# EasyEDA Pro project Const_IMU.eprj

# Schematic Schematic1
Create Date: 2024-10-29; Page Name: P1; Project Name: Const_IMU; Schematic Name: Schematic1; Update Date: 2024-10-30; Company: 嘉立创EDA; Page Size: A4; Version: V1.0
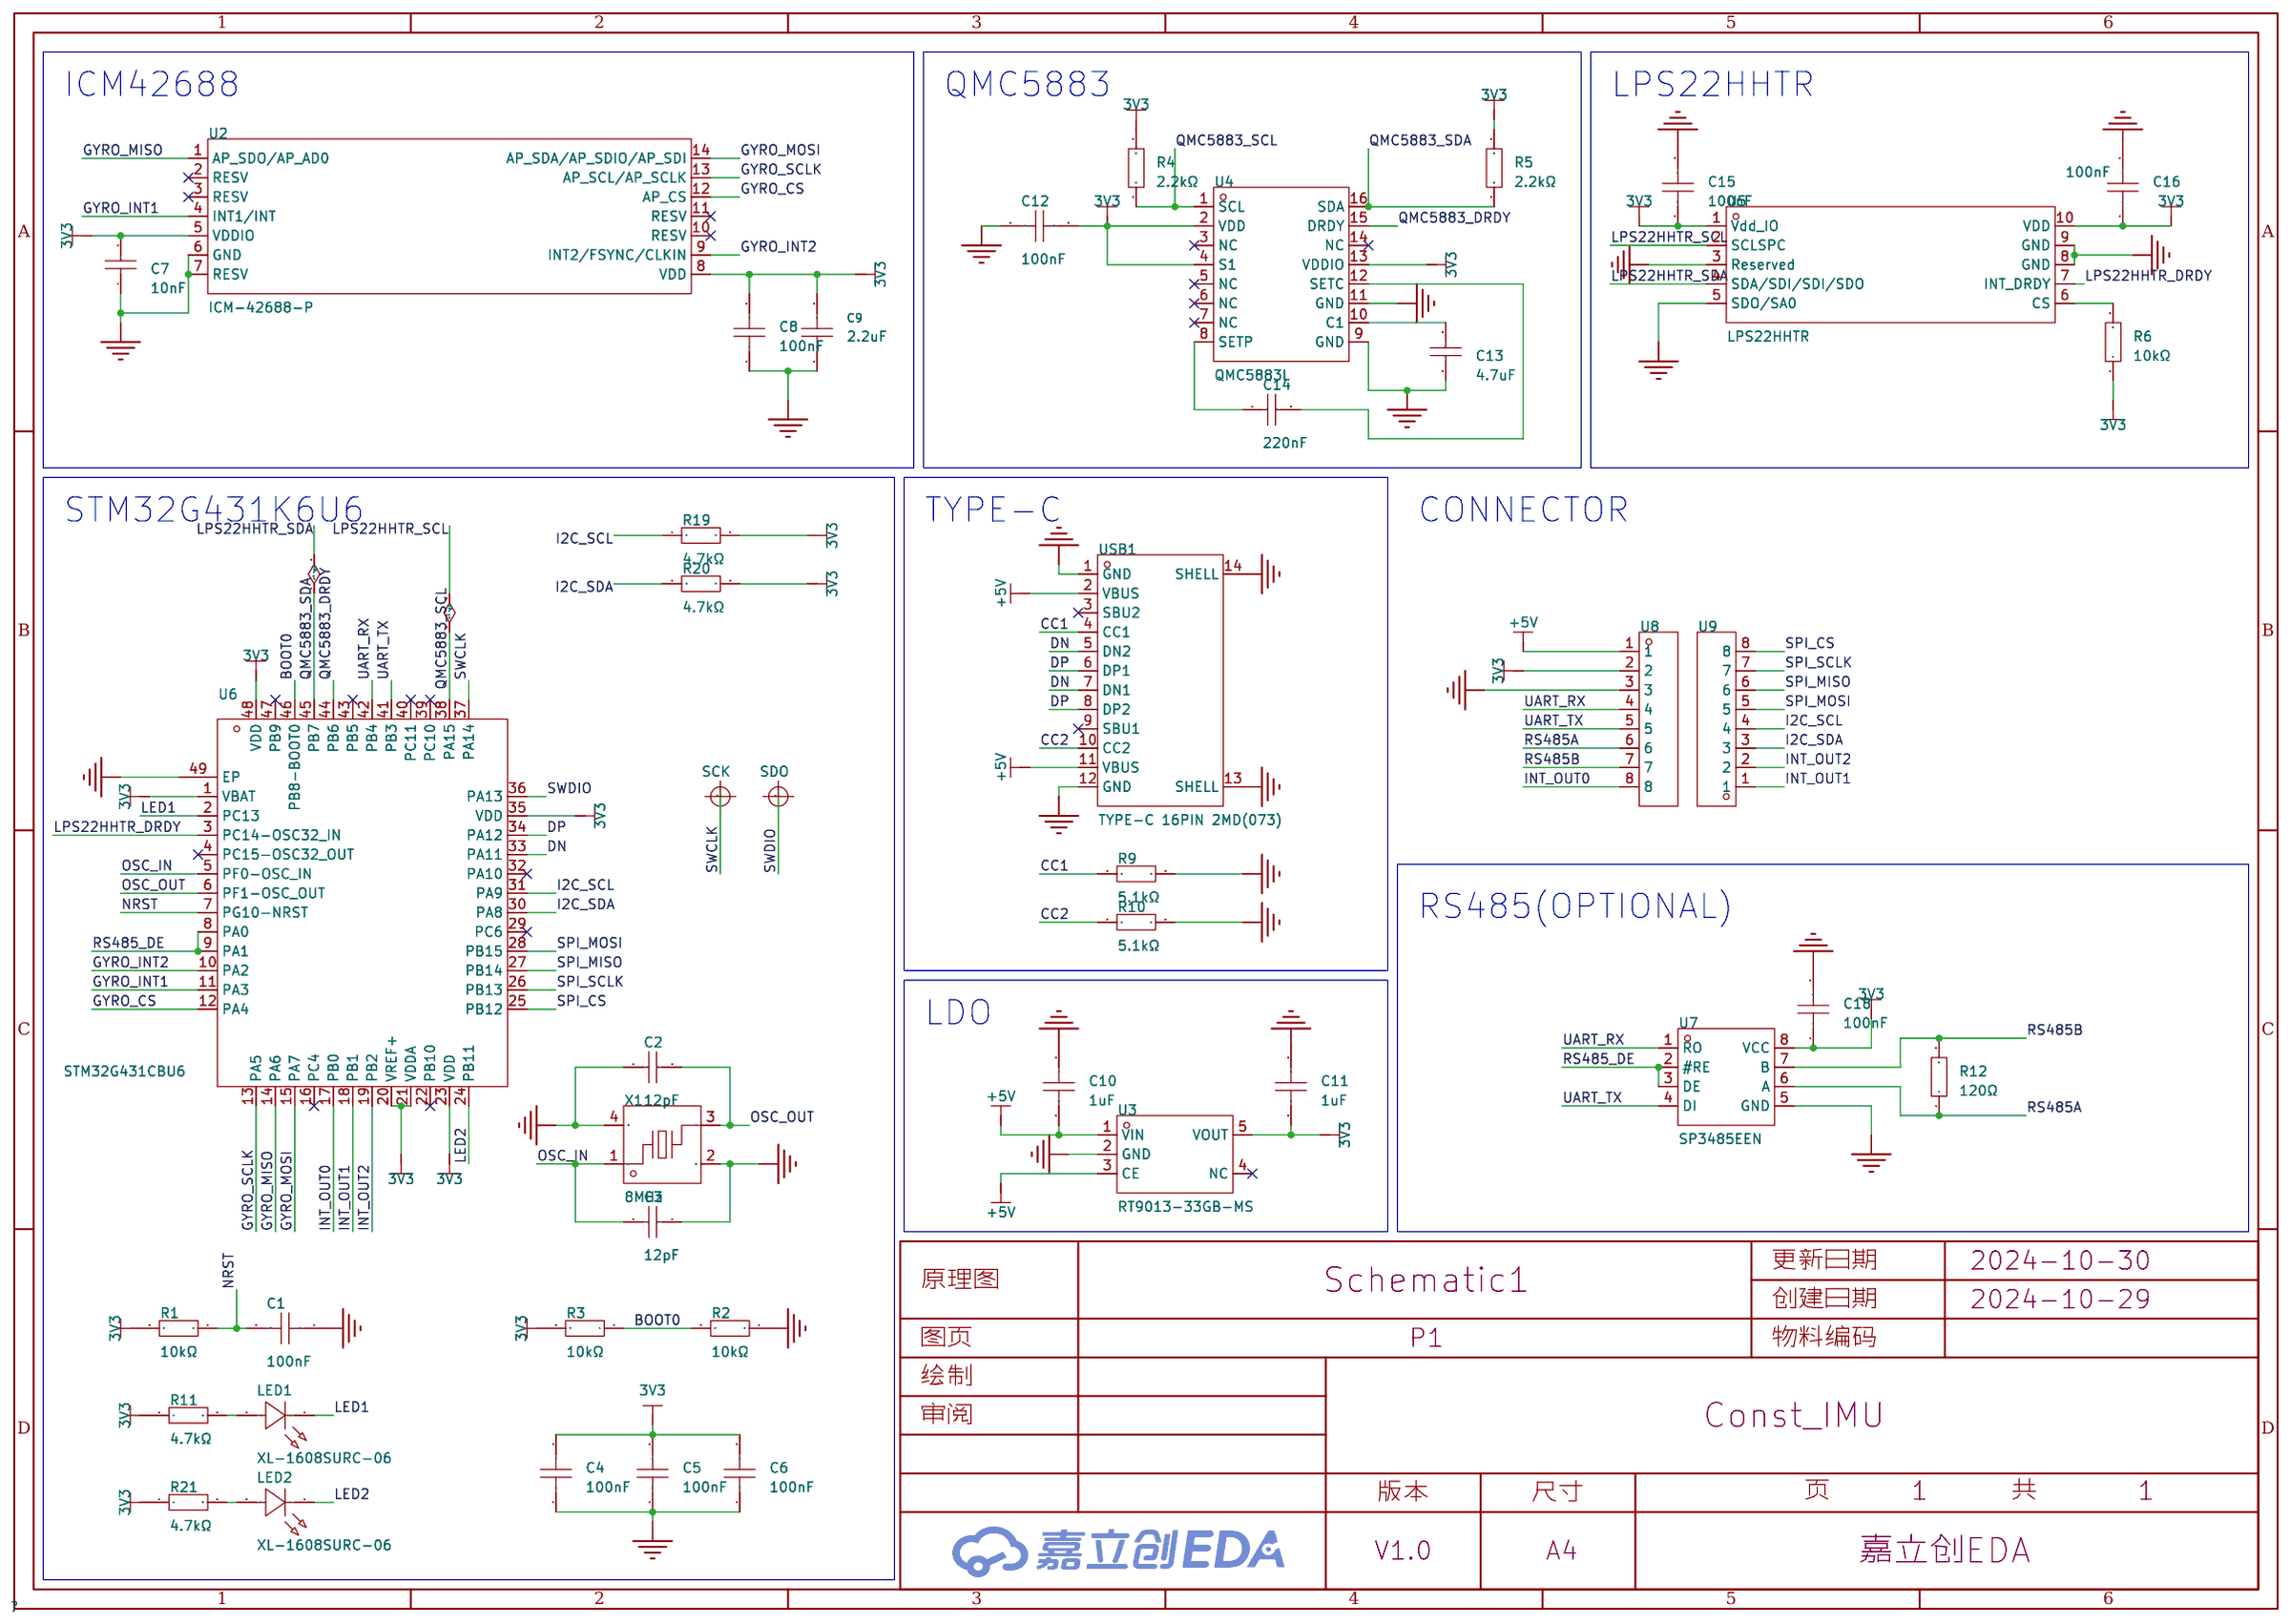
[diagram p0: schematic sheet]

## Parts
C1  100nF  [C0603]
C2  12pF  [C0603]
C3  12pF  [C0603]
C4  100nF  [C0603]
C5  100nF  [C0603]
C6  100nF  [C0603]
C7  10nF  [C0603]
C8  100nF  [C0603]
C9  2.2uF  [C0603]
C10  1uF  [C0603]
C11  1uF  [C0603]
C12  100nF  [C0603]
C13  4.7uF  [C0603]
C14  220nF  [C0603]
C15  100nF  [C0603]
C16  100nF  [C0603]
C18  100nF  [C0603]
LED1  XL-1608SURC-06  [LED0603-RD_RED]
LED2  XL-1608SURC-06  [LED0603-RD_RED]
R1  10kΩ  [R0603]
R2  10kΩ  [R0603]
R3  10kΩ  [R0603]
R4  2.2kΩ  [R0603]
R5  2.2kΩ  [R0603]
R6  10kΩ  [R0603]
R9  5.1kΩ  [R0603]
R10  5.1kΩ  [R0603]
R11  4.7kΩ  [R0603]
R12  120Ω  [R0603]
R19  4.7kΩ  [R0603]
R20  4.7kΩ  [R0603]
R21  4.7kΩ  [R0603]
SCK  -  [Mark-Point-1mm]  (no BOM)
SDO  -  [Mark-Point-1mm]  (no BOM)
U2  ICM-42688-P  [LGA-14_L3.0-W2.5-P0.50-TL]
U3  RT9013-33GB-MS  [SOT-23-5_L2.9-W1.6-P0.95-LS2.8-BR]
U4  QMC5883L  [LGA-16_L3.0-W3.0-P0.50-BL_SQ]
U5  LPS22HHTR  [HLGA-10L_LPS22HBTR]
U6  STM32G431CBU6  [UFQFPN-48_L7.0-W7.0-P0.50-BL-EP]
U7  SP3485EEN  [sop-8_l5.0-w4.0-p1.27-ls6.0-bl]
U8  HB-PH3-25418PB2GOP  [HDR-TH_8P-P2.54-V-M]
U9  HB-PH3-25418PB2GOP  [HDR-TH_8P-P2.54-V-M]
USB1  TYPE-C 16PIN 2MD(073)  [USB-C-SMD_TYPE-C-6PIN-2MD-073]
X1  8MHz  [OSC-SMD_4P-L3.2-W2.5-BL]

## Library data of the parts
C1 C4-C6 C8 C12 C15 C16 C18 = CGA0603X7R104K500JT: 容值:100nF;精度:±10%;额定电压:50V;材质(温度系数):X7R;; LCSC Part Name: 100nF ±10% 50V; Supplier Part: C6119867; Manufacturer: HRE(芯声); Supplier Footprint: 0603; JLCPCB Part Class: 扩展库; Supplier: LCSC; Tolerance: ±10%; Voltage Rated: 50V; Temperature Coefficient: X7R
C2 C3 = CL10C120JB8NNNC: 容值:12pF;精度:±5%;额定电压:50V;材质(温度系数):C0G;; LCSC Part Name: 12pF ±5% 50V; Supplier Part: C38523; Manufacturer: SAMSUNG(三星); Supplier Footprint: 0603; JLCPCB Part Class: Basic Part; Datasheet: https://atta.szlcsc.com/upload/public/pdf/source/20160218/1457707763339.pdf; Supplier: LCSC; Tolerance: ±5%; Voltage Rated: 50V; Temperature Coefficient: C0G
C7 = CC0603KRX7R9BB103: 容值:10nF;精度:±10%;额定电压:50V;材质(温度系数):X7R;; LCSC Part Name: 10nF ±10% 50V; Supplier Part: C100042; Manufacturer: YAGEO(国巨); Supplier Footprint: 0603; JLCPCB Part Class: Extended Part; Datasheet: https://atta.szlcsc.com/upload/public/pdf/source/20181008/C309510_22F155564471FAF6A489F7D68F34234E.pdf; Supplier: LCSC; Tolerance: ±10%; Voltage Rated: 50V; Temperature Coefficient: X7R
C9 = CL10A225KB8NNNC: 容值:2.2uF;精度:±10%;额定电压:50V;材质(温度系数):X5R;; LCSC Part Name: 2.2uF ±10% 50V; Supplier Part: C913904; Manufacturer: SAMSUNG(三星); Supplier Footprint: 0603; JLCPCB Part Class: 扩展库; Datasheet: https://atta.szlcsc.com/upload/public/pdf/source/20160218/1457707763339.pdf; Supplier: LCSC; Tolerance: ±10%; Voltage Rated: 50V; Temperature Coefficient: X5R
C10 C11 = CGA0603X5R105K160JT: 容值:1uF;精度:±10%;额定电压:16V;材质(温度系数):X5R;; LCSC Part Name: 1uF ±10% 16V; Supplier Part: C6119849; Manufacturer: HRE(芯声); Supplier Footprint: 0603; JLCPCB Part Class: Extended Part; Supplier: LCSC; Tolerance: ±10%; Voltage Rated: 16V; Temperature Coefficient: X5R
C13 = CL10A475KO8NNNC: 容值:4.7uF;精度:±10%;额定电压:16V;材质(温度系数):X5R;; LCSC Part Name: 4.7uF ±10% 16V; Supplier Part: C19666; Manufacturer: SAMSUNG(三星); Supplier Footprint: 0603; JLCPCB Part Class: Basic Part; Datasheet: https://atta.szlcsc.com/upload/public/pdf/source/20160218/1457707763339.pdf; Supplier: LCSC; Tolerance: ±10%; Voltage Rated: 16V; Temperature Coefficient: X5R
C14 = CL10B224KA8NNNC: 容值:220nF;精度:±10%;额定电压:25V;材质(温度系数):X7R;; LCSC Part Name: 220nF ±10% 25V; Supplier Part: C21120; Manufacturer: SAMSUNG(三星); Supplier Footprint: 0603; JLCPCB Part Class: Basic Part; Datasheet: https://atta.szlcsc.com/upload/public/pdf/source/20160218/1457707763339.pdf; Supplier: LCSC; Tolerance: ±10%; Voltage Rated: 25V; Temperature Coefficient: X7R
LED1 LED2 = XL-1608SURC-06: 发光颜色:红色;功率:55mW;正向电流:25mA;主波长:617nm~621nm;透镜颜色:无色透明透镜;色温:-;发光角度:120°;载带方式:正贴;工作温度:-30℃~+85℃;; Supplier Part: C965799; Manufacturer: XINGLIGHT(成兴光); Supplier Footprint: 0603; JLCPCB Part Class: Extended Part; Datasheet: https://atta.szlcsc.com/upload/public/pdf/source/20221102/D860AFDD1CDB02C5A8064103A32707E2.pdf; Supplier: LCSC; Emitted Color: 红色; Power Dissipation: 55mW; Forward Current: 25mA; Dominant Wavelength: 617nm~621nm; Peak Wavelength: 623nm; Lens Color: 无色透明透镜; Viewing Angle: 120°; Mounting Sytle: 正贴; Operating Temperature: -30℃~+85℃
R1-R3 R6 = 0603WAF1002T5E: 电阻类型:厚膜电阻;阻值:10kΩ;精度:±1%;功率:100mW;最大工作电压:75V;温度系数:±100ppm/℃;; LCSC Part Name: 厚膜电阻 10kΩ ±1% 100mW; Supplier Part: C25804; Manufacturer: UNI-ROYAL(厚声); Supplier Footprint: 0603; JLCPCB Part Class: Basic Part; Datasheet: https://atta.szlcsc.com/upload/public/pdf/source/20200306/C422600_1E6D84923E4A46A82E41ADD87F860B5C.pdf; Supplier: LCSC; Type: 厚膜电阻; Tolerance: ±1%; Power(Watts): 100mW; Overload Voltage (Max): 75V; Temperature Coefficient: ±100ppm/℃; Operating Temperature Range: -55℃~+155℃
R4 R5 = 0603WAF2201T5E: 电阻类型:厚膜电阻;阻值:2.2kΩ;精度:±1%;功率:100mW;最大工作电压:75V;温度系数:±100ppm/℃;; LCSC Part Name: 2.2kΩ ±1% 100mW 厚膜电阻; Supplier Part: C4190; Manufacturer: UNI-ROYAL(厚声); Supplier Footprint: 0603; JLCPCB Part Class: 基础库; Datasheet: https://atta.szlcsc.com/upload/public/pdf/source/20200306/C422600_1E6D84923E4A46A82E41ADD87F860B5C.pdf; Supplier: LCSC; Type: 厚膜电阻; Tolerance: ±1%; Power(Watts): 100mW; Overload Voltage (Max): 75V; Temperature Coefficient: ±100ppm/℃; Operating Temperature Range: -55℃~+155℃
R9 R10 = 0603WAF5101T5E: 电阻类型:厚膜电阻;阻值:5.1kΩ;精度:±1%;功率:100mW;最大工作电压:75V;温度系数:±100ppm/℃;; LCSC Part Name: 5.1kΩ ±1% 100mW 厚膜电阻; Supplier Part: C23186; Manufacturer: UNI-ROYAL(厚声); Supplier Footprint: 0603; JLCPCB Part Class: Basic Part; Datasheet: https://atta.szlcsc.com/upload/public/pdf/source/20200306/C422600_1E6D84923E4A46A82E41ADD87F860B5C.pdf; Supplier: LCSC; Type: 厚膜电阻; Tolerance: ±1%; Power(Watts): 100mW; Overload Voltage (Max): 75V; Temperature Coefficient: ±100ppm/℃; Operating Temperature Range: -55℃~+155℃
R11 R19-R21 = 0603WAF4701T5E: 电阻类型:厚膜电阻;阻值:4.7kΩ;精度:±1%;功率:100mW;最大工作电压:75V;温度系数:±100ppm/℃;; LCSC Part Name: 4.7kΩ ±1% 100mW 厚膜电阻; Supplier Part: C23162; Manufacturer: UNI-ROYAL(厚声); Supplier Footprint: 0603; JLCPCB Part Class: 基础库; Datasheet: https://atta.szlcsc.com/upload/public/pdf/source/20200306/C422600_1E6D84923E4A46A82E41ADD87F860B5C.pdf; Supplier: LCSC; Type: 厚膜电阻; Tolerance: ±1%; Power(Watts): 100mW; Overload Voltage (Max): 75V; Temperature Coefficient: ±100ppm/℃; Operating Temperature Range: -55℃~+155℃
R12 = 0603WAF1200T5E: 电阻类型:厚膜电阻;阻值:120Ω;精度:±1%;功率:100mW;最大工作电压:75V;温度系数:±100ppm/℃;; LCSC Part Name: 120Ω ±1% 100mW 厚膜电阻; Supplier Part: C22787; Manufacturer: UNI-ROYAL(厚声); Supplier Footprint: 0603; JLCPCB Part Class: Basic Part; Datasheet: https://atta.szlcsc.com/upload/public/pdf/source/20200306/C422600_1E6D84923E4A46A82E41ADD87F860B5C.pdf; Supplier: LCSC; Type: 厚膜电阻; Tolerance: ±1%; Power(Watts): 100mW; Overload Voltage (Max): 75V; Temperature Coefficient: ±100ppm/℃; Operating Temperature Range: -55℃~+155℃
SCK SDO = Mark-Point: Mark点
U2 = ICM-42688-P: 传感器类型:加速度计陀螺仪;; Supplier Part: C1850418; Manufacturer: TDK InvenSense(应美盛); Supplier Footprint: LGA-14(2.5x3); JLCPCB Part Class: 扩展库; Datasheet: https://atta.szlcsc.com/upload/public/pdf/source/20210703/CF24204867ACE5B754A2B035F23E5931.pdf; Supplier: LCSC; Sensor Type: 加速度计陀螺仪
U3 = RT9013-33GB-MS: 输出类型:固定;最大输入电压:5.5V;输出电压:3.3V;最大输出电流:500mA;电源纹波抑制比(PSRR):75dB@(1kHz);输出极性:正极;; Supplier Part: C7434207; Manufacturer: MSKSEMI(美森科); Supplier Footprint: SOT-23-5; JLCPCB Part Class: 扩展库; Datasheet: https://atta.szlcsc.com/upload/public/pdf/source/20230705/1D6536D82D93AC1E044F3DAE104751D9.pdf; Supplier: LCSC; Output Type: 固定; Maximum Input Voltage: 5.5V; Output Voltage: 3.3V; MAX Output Current: 500mA; Power Supply Rejection Ratio (PSRR): 75dB@(1kHz); Output Polarity: 正极
U4 = QMC5883L: LCSC Part Name: 三轴磁传感器; Supplier Part: C976032; Manufacturer: QST(上海矽睿); Supplier Footprint: LGA-16(3x3); JLCPCB Part Class: 扩展库; Datasheet: https://atta.szlcsc.com/upload/public/pdf/source/20201217/C976032_5B9A2F3901E175046CBA037B1F18A1F2.pdf; Supplier: LCSC
U5 = LPS22HHTR: 压力范围:26Kpa~126Kpa;; Supplier Part: C2827824; Manufacturer: ST(意法半导体); Supplier Footprint: HLGA-10(2x2); JLCPCB Part Class: 扩展库; Datasheet: https://atta.szlcsc.com/upload/public/pdf/source/20210707/C2827824_E4CD2E1AEEC461DC537A3A43C6466376.pdf; Supplier: LCSC; Pressure range: 26Kpa~126Kpa; The Power Supply Voltage: 1.7V~3.6V; Operating Temperature: -40℃~+85℃
U6 = STM32G431CBU6: CPU内核:-;程序存储容量:128KB;RAM总容量:32KB;GPIO端口数量:42;工作电压范围:1.71V~3.6V;CPU最大主频:170MHz;程序存储器类型:FLASH;; LCSC Part Name: 带DSP和FPU的170MHz主流ARM Cortex-M4 MCU，具有128 KB Flash存储器、数学加速器和中等模拟电平集成; Supplier Part: C529356; Manufacturer: ST(意法半导体); Supplier Footprint: UFQFPN-48(7x7); JLCPCB Part Class: 扩展库; Datasheet: https://atta.szlcsc.com/upload/public/pdf/source/20200511/C529354_7C66CF00837B904D0C15DCE45B69418C.pdf; Supplier: LCSC; Program Storage Size: 128KB; RAM Size: 32KB; GPIO Ports Number: 42; Operating Voltage Range: 1.71V~3.6V; CPU Maximum Speed: 170MHz; Program Memory Type: FLASH; Operating Temperature Range: -40℃~+85℃; ADC (Bit): 12bit; DAC (Bit): 12bit; Peripheral/Function: DMA；PWM; Watchdog: 有; Infrared Data Association: 有; Low-Voltage Detect: 有; Direct Memory Access: 有; Internal Oscillator: 有
U7 = SP3485EEN: 类型:收发器;数据速率:12Mbps;驱动器/接收器:1/1;; Supplier Part: C668205; Manufacturer: UMW(友台半导体); Supplier Footprint: SOP-8; JLCPCB Part Class: Extended Part; Datasheet: https://atta.szlcsc.com/upload/public/pdf/source/20231109/A068A439CF0AE9265B075B2C5F4AA545.pdf; Supplier: LCSC; Types: 收发器; Supply Voltage: 2.97V~3.63V; Data Rate: 12Mbps; Driver/receiver: 1/1; Operating Temperature: -40℃~+85℃
U8 U9 = HB-PH3-25418PB2GOP: 插针结构:1x8P;间距:2.54mm;行距:2.54mm;圆针/方针:方针;安装类型:直插;排数:单排;总PIN位数:8P;额定电流:3A;额定电压:250V;配合针长度:6mm;塑高:2.54mm;端接针长度:3mm;触头材质:黄铜;触头镀层:金;工作温度范围:-40℃~+105℃;焊接温度(最大值):260℃;颜色:黑色;; LCSC Part Name: 间距:2.54mm 1x8P 直插 方针; Supplier Part: C6332201; Manufacturer: HANBO(汉博); Supplier Footprint: 插件,P=2.54mm; JLCPCB Part Class: Extended Part; Datasheet: https://atta.szlcsc.com/upload/public/pdf/source/20230803/F72D259687963761DF1B552F3BB84A31.pdf; Supplier: LCSC; Pin Structure: 1x8P; Pitch: 2.54mm; Row Spacing: 2.54mm; Circluar Pins/Square Pins: 方针; Mounting Type: 直插; Number of Rows: 单排; Number of Pins: 8P; Current Rating (Max): 3A; Voltage Rating (Max): 250V; Length of Mating Pin: 6mm; Insulation Height: 2.54mm; Length of End Connection Pin: 3mm; Contact Material: 黄铜; Contact Plating: 金; Operating Temperature Range: -40℃~+105℃; Soldering Temperature(Max): 260℃; Color: 黑色
USB1 = TYPE-C 16PIN 2MD(073): 连接器类型:Type-C;标准:USB 3.1;公母:母;安装方式:卧贴;触点数量:16P;端口数量:1;额定电流 - 电源:5A;工作温度范围:-25℃~+85℃;; LCSC Part Name: Type-C 母 卧贴; Supplier Part: C2765186; Manufacturer: SHOU HAN(首韩); Supplier Footprint: SMD; JLCPCB Part Class: Extended Part; Datasheet: https://atta.szlcsc.com/upload/public/pdf/source/20211123/39B17C16241EAC15C5E277BDA434118E.pdf; Supplier: LCSC; Connector Type: Type-C; Standard: USB 3.1; Gender: 母; Mounting Style: 卧贴; Number of Contacts: 16P; Number of Ports: 1; Current Rating - Power (Max): 5A; Operating Temperature Range: -25℃~+85℃; Rated Voltage (Max): 5V; Connect-Disconnect Life: 5千次; Core Colour: 黑色
X1 = X32258MOB4SI: 晶振类型:贴片晶振;频率:8MHz;常温频差:±10ppm;外接负载电容:12pF;频率稳定度(全温):±20ppm;; LCSC Part Name: 8MHz ±10ppm 12pF; Supplier Part: C2682775; Manufacturer: YXC(扬兴晶振); Supplier Footprint: SMD3225-4P; JLCPCB Part Class: 扩展库; Datasheet: https://atta.szlcsc.com/upload/public/pdf/source/20240329/19D5F850207469550BEB00D7DFEDBC7A.pdf; Supplier: LCSC; Crystal Type: 贴片晶振; Normal temperature Frequency Tolerance: ±10ppm; External load capacitor: 12pF; Frequency Stability(Full temperature range): ±20ppm; Equivalent Series Resistance (ESR): 150Ω; Operating Temperature: -40℃~+85℃

## Nets
3V3: C4.2 C5.2 C6.2 C7.2 C8.2 C9.2 C11.1 C12.2 C15.1 C16.1 C18.1 R1.2 R3.2 R4.2 R5.2 R6.1 R11.1 R19.2 R20.2 R21.1 U2.5(VDDIO) U2.8(VDD) U3.5(VOUT) U4.2(VDD) U4.4(S1) U4.13(VDDIO) U5.1(Vdd_IO) U5.10(VDD) U6.1(VBAT) U6.20(VREF+) U6.21(VDDA) U6.23(VDD) U6.35(VDD) U6.48(VDD) U7.8(VCC) U8.2
+5V: C10.1 U3.1(VIN) U3.3(CE) U8.1 USB1.2(VBUS) USB1.11(VBUS)
GND: C1.1 C2.1 C3.2 C4.1 C5.1 C6.1 C7.1 C8.1 C9.1 C10.2 C11.2 C12.1 C13.1 C15.2 C16.2 C18.2 R2.1 R9.2 R10.2 U2.6(GND) U2.7(RESV) U3.2(GND) U4.9(GND) U4.11(GND) U5.3(Reserved) U5.5(SDO/SA0) U5.8(GND) U5.9(GND) U6.49(EP) U7.5(GND) U8.3 USB1.1(GND) USB1.12(GND) USB1.13(SHELL) USB1.14(SHELL) X1.2(GND) X1.4(GND)
BOOT0: R2.2 R3.1 U6.46(PB8-BOOT0)
CC1: R9.1 USB1.4(CC1)
CC2: R10.1 USB1.10(CC2)
DN: U6.33(PA11) USB1.5(DN2) USB1.7(DN1)
DP: U6.34(PA12) USB1.6(DP1) USB1.8(DP2)
GYRO_CS: U2.12(AP_CS) U6.12(PA4)
GYRO_INT1: U2.4(INT1/INT) U6.11(PA3)
GYRO_INT2: U2.9(INT2/FSYNC/CLKIN) U6.10(PA2)
GYRO_MISO: U2.1(AP_SDO/AP_AD0) U6.14(PA6)
GYRO_MOSI: U2.14(AP_SDA/AP_SDIO/AP_SDI) U6.15(PA7)
GYRO_SCLK: U2.13(AP_SCL/AP_SCLK) U6.13(PA5)
I2C_SCL: R19.1 U6.31(PA9) U9.4
I2C_SDA: R20.1 U6.30(PA8) U9.3
INT_OUT0: U6.17(PB0) U8.8
INT_OUT1: U6.18(PB1) U9.1
INT_OUT2: U6.19(PB2) U9.2
LED1: LED1.1(K) U6.2(PC13)
LED2: LED2.1(K) U6.24(PB11)
LPS22HHTR_DRDY: U5.7(INT_DRDY) U6.3(PC14-OSC32_IN)
LPS22HHTR_SCL: R4.1 U4.1(SCL) U5.2(SCLSPC) U6.38(PA15)
LPS22HHTR_SDA: R5.1 U4.16(SDA) U5.4(SDA/SDI/SDI/SDO) U6.45(PB7)
NRST: C1.2 R1.1 U6.7(PG10-NRST)
OSC_IN: C3.1 U6.5(PF0-OSC_IN) X1.1
OSC_OUT: C2.2 U6.6(PF1-OSC_OUT) X1.3
QMC5883_DRDY: U4.15(DRDY) U6.44(PB6)
RS485_DE: U6.8(PA0) U6.9(PA1) U7.2(#RE) U7.3(DE)
RS485A: R12.1 U7.6(A) U8.6
RS485B: R12.2 U7.7(B) U8.7
SPI_CS: U6.25(PB12) U9.8
SPI_MISO: U6.27(PB14) U9.6
SPI_MOSI: U6.28(PB15) U9.5
SPI_SCLK: U6.26(PB13) U9.7
SWCLK: SCK.1 U6.37(PA14)
SWDIO: SDO.1 U6.36(PA13)
UART_RX: U6.42(PB4) U7.1(RO) U8.4
UART_TX: U6.41(PB3) U7.4(DI) U8.5
$1N2964: C13.2 U4.10(C1)
$1N3054: C14.1 U4.8(SETP)
$1N3058: C14.2 U4.12(SETC)
$1N3582: R6.2 U5.6(CS)
$1N7651: LED1.2(A) R11.2
$1N9567: LED2.2(A) R21.2

Not connected (* = marked no-connect by the designer): U2 2(RESV)* 3(RESV)* 10(RESV)* 11(RESV)*; U3 4(NC)*; U4 3(NC)* 5(NC)* 6(NC)* 7(NC)* 14(NC)*; U6 4(PC15-OSC32_OUT)* 16(PC4)* 22(PB10)* 29(PC6)* 32(PA10)* 39(PC10)* 40(PC11)* 43(PB5)* 47(PB9)*; USB1 3(SBU2)* 9(SBU1)*

## Notes on the sheet
- ICM42688
- QMC5883
- LPS22HHTR
- STM32G431K6U6
- TYPE-C
- CONNECTOR
- RS485(OPTIONAL)
- LDO

# Board PCB1
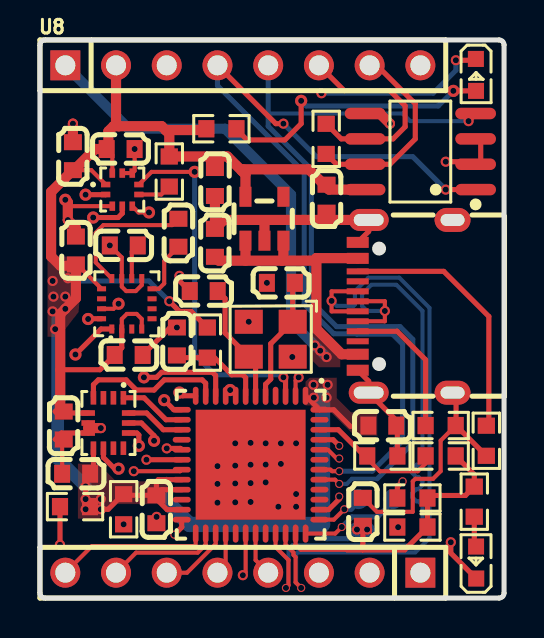
[diagram p1: board, top side]
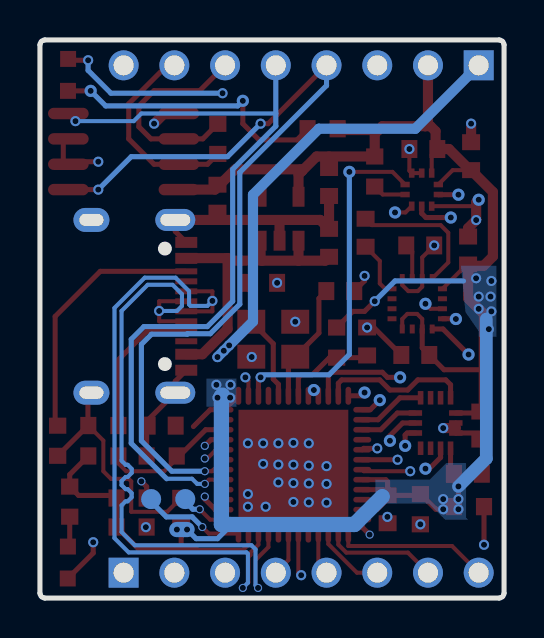
[diagram p2: board, bottom side, seen from below]

Outline 23.24 x 27.94 mm; copper layers: Top Layer, Inner1, Inner2, Bottom Layer. Coordinates in mm from the lower left corner of the outline.
Outline path: 0,27.69 0,0.25 arc(0.07,0.07) 0.25,0 22.99,0 arc(23.17,0.07) 23.24,0.25 23.24,27.69 arc(23.17,27.87) 22.99,27.94 0.25,27.94 arc(0.07,27.87) 0,27.69
Stack: Top Layer 0.035mm 外层铜厚1oz / Dielectric1 0.2104mm 7628 RC49% 8.6mil / Inner1 0.0152mm 内层铜厚 / Dielectric2 1.065mm 1.1mm H/HOZ 含铜 / Inner2 0.0152mm 内层铜厚 / Dielectric3 0.2104mm 7628 RC49% 8.6mil / Bottom Layer 0.035mm 外层铜厚1oz

## Design rules (mm)
net DN: DP1
net DP: DP1
template: 自定义配置
spacing copperThickness1oz (default): track to track 0.102, other pairs 0.152 to 0.3
spacing copperThickness2oz: track to track 0.203, other pairs 0.152 to 0.3
track width copperThickness1oz (default): min 0.127, default 0.254, max 2.54
track width copperThickness2oz: min 0.203, default 0.254, max 2.54
differential pair differentialPair (default): width min 0.127, default 0.254, max 2.54; gap min 0.152, default 0.152
via viaSize (default): diameter min 0.4, default 0.61, max 10; hole min 0.3, default 0.305, max 6.3
net GND uses copperRegion1

## Placement (name value [footprint] x y rotation side)
C1  100nF  [C0603]  6.86 12.84 270 top
C2  12pF  [C0603]  8.2 15.37 0 top
C3  12pF  [C0603]  12.06 15.78 180 top
C4  100nF  [C0603]  5.83 4.45 90 top
C5  100nF  [C0603]  16.17 4.32 270 top
C6  100nF  [C0603]  17.15 8.63 180 top
C7  10nF  [C0603]  1.81 6.22 0 top
C8  100nF  [C0603]  1.19 8.64 90 top
C9  2.2uF  [C0603]  4.44 12.17 180 top
C10  1uF  [C0603]  8.76 17.78 90 top
C11  1uF  [C0603]  8.76 20.83 270 top
C12  100nF  [C0603]  1.8 17.4 270 top
C13  4.7uF  [C0603]  4.2 17.65 0 top
C14  220nF  [C0603]  6.93 18.29 90 top
C15  100nF  [C0603]  1.65 22.12 90 top
C16  100nF  [C0603]  4.04 22.48 0 top
C18  100nF  [C0603]  14.35 19.99 270 top
LED1  XL-1608SURC-06  [LED0603-RD_RED]  21.84 1.78 90 top
LED2  XL-1608SURC-06  [LED0603-RD_RED]  21.83 26.19 270 top
R1  10kΩ  [R0603]  8.38 12.79 90 top
R2  10kΩ  [R0603]  17.15 7.11 180 top
R3  10kΩ  [R0603]  20.07 7.11 0 top
R4  2.2kΩ  [R0603]  1.76 4.58 0 top
R5  2.2kΩ  [R0603]  4.19 4.45 90 top
R6  10kΩ  [R0603]  6.48 21.35 270 top
R9  5.1kΩ  [R0603]  20.07 8.64 0 top
R10  5.1kΩ  [R0603]  22.35 7.87 270 top
R11  4.7kΩ  [R0603]  21.75 4.83 270 top
R12  120Ω  [R0603]  14.33 22.99 270 top
R19  4.7kΩ  [R0603]  18.65 5.01 0 top
R20  4.7kΩ  [R0603]  18.65 3.56 0 top
R21  4.7kΩ  [R0603]  9.09 23.5 0 top
SCK  -  [mark-point-1mm]  15.96 4.95 90 top
SDO  -  [mark-point-1mm]  17.67 4.95 90 top
U2  ICM-42688-P  [LGA-14_L3.0-W2.5-P0.50-TL]  3.43 8.76 270 top
U3  RT9013-33GB-MS  [SOT-23-5_L2.9-W1.6-P0.95-LS2.8-BR]  11.24 18.99 270 top
U4  QMC5883L  [LGA-16_L3.0-W3.0-P0.50-BL_SQ]  4.35 14.73 0 top
U5  LPS22HHTR  [HLGA-10L_LPS22HBTR]  4.12 20.45 0 top
U6  STM32G431CBU6  [UFQFPN-48_L7.0-W7.0-P0.50-BL-EP]  10.55 6.68 180 top
U7  SP3485EEN  [sop-8_l5.0-w4.0-p1.27-ls6.0-bl]  19.05 22.35 90 top
U8  HB-PH3-25418PB2GOP  [HDR-TH_8P-P2.54-V-M]  10.16 26.67 0 top
U9  HB-PH3-25418PB2GOP  [HDR-TH_8P-P2.54-V-M]  10.16 1.27 180 top
USB1  TYPE-C 16PIN 2MD(073)  [USB-C-SMD_TYPE-C-6PIN-2MD-073]  18.29 14.61 90 top
X1  8MHz  [OSC-SMD_4P-L3.2-W2.5-BL]  11.56 12.96 180 top

## Footprints (pads in the part's own frame, mm; a bottom-side part is the same pattern mirrored in y, then rotated)
C0603
  rect 0.8x0.9 smd: 1(-0.7,0) 2(0.7,0)
HDR-TH_8P-P2.54-V-M
  rect 1.5x1.5 hole 1: 1(-8.89,0)
  round 1.5 hole 1: 2(-6.35,0) 3(-3.81,0) 4(-1.27,0) 5(1.27,0) 6(3.81,0) 7(6.35,0) 8(8.89,0)
HLGA-10L_LPS22HBTR
  rect 0.465x0.28 smd: 1(-0.833,0.255) 2(-0.833,-0.245) 6(0.833,-0.245) 7(0.833,0.255)
  rect 0.28x0.465 smd: 3(-0.5,-0.828) 4(0,-0.828) 5(0.5,-0.828) 8(0.5,0.828) 9(0,0.828) 10(-0.5,0.828)
LED0603-RD_RED
  rect 0.8x0.8 smd: 1(-0.799,-0.004) 2(0.799,0.004)
LGA-14_L3.0-W2.5-P0.50-TL
  rect 0.675x0.28 smd: 1(-1.262,0.75) 2(-1.262,0.25) 3(-1.262,-0.25) 4(-1.262,-0.75) 8(1.262,-0.75) 9(1.262,-0.25) 10(1.262,0.25) 11(1.262,0.75)
  rect 0.28x0.675 smd: 5(-0.5,-1.012) 6(0,-1.012) 7(0.5,-1.012) 12(0.5,1.012) 13(0,1.012) 14(-0.5,1.012)
LGA-16_L3.0-W3.0-P0.50-BL_SQ
  rect 0.25x0.45 smd: 1(-0.75,-1.263) 2(-0.25,-1.263) 3(0.25,-1.263) 4(0.75,-1.263) 9(0.75,1.263) 10(0.25,1.263) 11(-0.25,1.263) 12(-0.75,1.263)
  rect 0.45x0.25 smd: 5(1.263,-0.75) 6(1.263,-0.25) 7(1.263,0.25) 8(1.263,0.75) 13(-1.263,0.75) 14(-1.263,0.25) 15(-1.263,-0.25) 16(-1.263,-0.75)
mark-point-1mm
  round 1 smd far side: 1(0,0)
OSC-SMD_4P-L3.2-W2.5-BL
  rect 1.4x1.2 smd: 1(-1.1,-0.875) 2(1.1,-0.875) 3(1.1,0.875) 4(-1.1,0.875)
R0603
  rect 0.806x0.864 smd: 1(-0.753,0) 2(0.753,0)
sop-8_l5.0-w4.0-p1.27-ls6.0-bl
  oval 0.574x2.035 smd: 1(-1.905,-2.768) 2(-0.635,-2.768) 3(0.635,-2.768) 4(1.905,-2.768) 5(1.905,2.768) 6(0.635,2.768) 7(-0.635,2.768) 8(-1.905,2.768)
SOT-23-5_L2.9-W1.6-P0.95-LS2.8-BR
  rect 1x0.6 smd: 1(1.1,-0.95) 2(1.1,0) 3(1.1,0.95) 4(-1.1,0.95) 5(-1.1,-0.95)
UFQFPN-48_L7.0-W7.0-P0.50-BL-EP
  oval 0.28x0.9 smd: 1(-2.751,-3.45) 2(-2.251,-3.45) 3(-1.75,-3.45) 4(-1.25,-3.45) 5(-0.749,-3.45) 6(-0.249,-3.45) 7(0.249,-3.45) 8(0.75,-3.45) 9(1.25,-3.45) 10(1.75,-3.45) 11(2.251,-3.45) 12(2.751,-3.45) 25(2.751,3.449) 26(2.251,3.449) 27(1.75,3.449) 28(1.25,3.449) 29(0.75,3.449) 30(0.249,3.449) 31(-0.249,3.449) 32(-0.749,3.449) 33(-1.25,3.449) 34(-1.75,3.449) 35(-2.251,3.449) 36(-2.751,3.449)
  oval 0.9x0.28 smd: 13(3.45,-2.751) 14(3.45,-2.251) 15(3.45,-1.75) 16(3.45,-1.25) 17(3.45,-0.75) 18(3.45,-0.249) 19(3.45,0.249) 20(3.45,0.749) 21(3.45,1.25) 22(3.45,1.75) 23(3.45,2.251) 24(3.45,2.751) 37(-3.449,2.751) 38(-3.449,2.251) 39(-3.449,1.75) 40(-3.449,1.25) 41(-3.449,0.749) 42(-3.449,0.249) 43(-3.449,-0.249) 44(-3.449,-0.75) 45(-3.449,-1.25) 46(-3.449,-1.75) 47(-3.449,-2.251) 48(-3.449,-2.751)
  rect 5.5x5.5 smd: 49(0,0)
USB-C-SMD_TYPE-C-6PIN-2MD-073
  rect 0.55x1.1 smd: 1(-3.2,2.375) 2(-2.4,2.375) 11(2.4,2.375) 12(3.2,2.375)
  rect 0.3x1.1 smd: 3(-1.75,2.375) 4(-1.25,2.375) 5(-0.75,2.375) 6(-0.25,2.375) 7(0.25,2.375) 8(0.75,2.375) 9(1.25,2.375) 10(1.75,2.375)
  oval 1.1x2 hole 0.6x1.5: 13(-4.325,1.825) 14(4.325,1.825)
  oval 1.2x1.8 hole 0.6x1.2: 13(-4.325,-2.375) 14(4.325,-2.375)

## Nets
As in the schematic.

Pads without a net: U2 2 3 10 11; U3 4; U4 3 5 6 7 14; U6 4 16 22 29 32 39 40 43 47; USB1 3 9

## Via types
v1: diameter 0.508, hole 0.305, Top Layer to Bottom Layer, 72 vias
v2: diameter 0.61, hole 0.305, Top Layer to Bottom Layer, 17 vias
v3: diameter 0.406, hole 0.305, Top Layer to Bottom Layer, 11 vias

## Routing (per net, layer and track width the routed paths; a pad name or vN(x,y) marks a point on that pad's centre or on a via; arc(x,y) is an arc through that point)
3V3: length 116.6
  Top Layer w0.203: U6.35 12.8,2.68 13.06,2.41 15.37,2.41 ; U5.10 3.62,22.2 C16.1 ; U4.13 1.87,16.7 C12.2 ; 1.7,21.42 2.57,21.42 3.29,20.7 ; 4.1,13.47 4.1,13.97 4.35,14.22 4.84,14.22 5.1,13.97 5.1,13.47
  Top Layer w0.254: C4.2 4.24,5.14 4.18,5.21 3.42,4.45 v1(3.05,4.45) v1(2.29,4.45) v1(2.29,4.95) v1(2.29,5.59) ; C4.2 6.11,5.43 U6.21 ; C4.2 5.83,5.83 5.93,5.93 U6.20 ; C4.2 5.83,4.96 6.37,4.43 U6.23 ; 15.56,8.59 14.72,9.43 U6.48 U6.1 ; R3.2 21.75,6.18 R11.1 21.3,5.13 19.41,5.13 R20.2 18.26,2.41 16.16,2.41 ; 1.02,11.43 3.01,11.43 C9.2 4.1,12.52 4.1,13.47 ; C5.2 16.17,2.42 16.16,2.41 ; 2.78,6.22 2.68,6.32 U2.8 ; 16.16,2.41 15.37,2.41 ; 0.76,9.34 0.84,9.26 U2.5 ; R1.2 7.57,14.35 6.99,14.35 v1(6.48,14.86)
  Top Layer w0.508: 6.29,23.43 8.27,23.43 R21.1 ; 6.29,23.43 6.48,23.24 R6.1 9.39,22.11 10.11,21.38 ; 6.29,23.43 6.1,23.62 3.95,23.62 ; C11.1 8.76,22.11 ; C8.2 1.02,9.51 1.02,14.22 v1(1.27,14.48) 1.8,15.01 C12.2 1.74,16.64 1.02,16.64 0.56,17.1 0.56,20.33 C15.1 1.7,21.42 2.76,22.48 C16.1 3.43,22.57 3.43,23.37 3.68,23.62 3.95,23.62 ; 16.54,20.45 14.48,20.45 13.46,21.46 10.19,21.46 10.11,21.38 ; U8.2 3.81,23.76 3.95,23.62 ; 10.11,21.38 10.29,21.2 U3.5
  Bottom Layer w0.254: v1(15.88,3.43) 15.42,2.97 14.35,2.97 13.88,3.45 13.88,3.68 ; v1(6.48,14.86) 5.46,15.88 2.03,15.88
  Bottom Layer w0.635: 0.89,13.97 0.89,6.98 v1(2.29,5.59)
  Bottom Layer w0.762: 14.1,10.16 14.15,10.1 14.15,3.68 7.49,3.68 6.1,5.08 ; v1(15.88,3.43) v1(16.38,3.43)
  vias: v1(0.63,15.88) v1(0.68,15.09) v1(0.63,14.35) v1(0.76,13.46) v1(1.27,15.09) v1(1.4,16.01) v1(3.05,4.95) v1(13.7,10.68) v1(13.72,10.03) v1(14.41,10.68) v1(14.35,10.03)
+5V: length 38.3
  Top Layer w0.508: 13.84,17.02 13.72,16.89 12.12,16.89 ; 13.84,17.02 15.9,17.02 USB1.11 ; 13.84,17.02 13.84,13.47 15.11,12.2 USB1.2 ; 10.29,16.89 8.95,16.89 C10.1 ; 10.29,16.89 U3.1 ; 10.29,16.89 12.12,16.89 ; 12.12,16.89 12.19,16.97 U3.3
  Bottom Layer w0.508: v1(14.35,12.06) v1(14.03,12.38) v1(13.77,12.65) 12.57,13.84 12.57,20.19 9.27,23.5 4.44,23.5 U8.1
GND: length 50.9
  Top Layer w0.203: v2(5.46,19.3) 4.94,19.3 U5.5 ; C5.1 16.87,4.32 18.67,4.32 18.67,5.84 18.8,5.97 19.69,5.97 20.07,6.35 20.07,7.88 R9.2 ; C7.1 1.11,7.59 0.76,7.94 ; U4.9 5.1,15.67 4.8,15.37 4.32,15.37 4.1,15.59 U4.11 4.1,17.05 v1(3.5,17.65) ; U5.9 U5.8 4.74,21.39 v1(4.74,22.48) ; U5.3 1.59,19.62 1.4,19.81
  Top Layer w0.254: 0.76,7.94 1.08,8.26 U2.7 U2.6 ; R2.1 17.9,8.58 C6.1 17.84,8.9 16.46,10.28 16.46,10.86 USB1.1 ; USB1.13 20.84,10.11 20.84,8.64 ; v1(5.84,4.06) 5.83,4.05 C4.1 ; 20.84,8.64 R9.2 ; 20.84,8.64 R10.2 ; C2.1 6.99,15.88 v1(6.99,16.13) ; v1(6.86,13.54) 6.52,13.54 5.15,12.17 ; USB1.12 16.46,18.36 16.46,18.93
  Top Layer w0.508: 2.42,8.51 2.42,8.51 v1(3.05,8.51) ; v2(1.27,19.94) 1.4,19.81 v1(1.4,18.92) 1.8,18.52 C12.1 ; 16.54,24.26 17.02,24.26 v1(17.53,23.75) ; C11.2 C10.2 9.21,18.93 16.46,18.93 ; C15.2 v1(1.65,23.75) ; U3.2 11.24,18.92
  vias: v1(8.89,6.6) v1(8.89,5.72) v1(8.89,4.77) v1(9.78,7.75) v1(9.78,6.63) v1(9.78,5.74) v1(9.78,4.79) v1(10.46,13.83) v1(10.55,7.77) v1(10.55,6.68) v1(10.55,5.75) v1(10.55,4.81) v1(11.3,7.75) v1(11.3,6.68) v1(11.3,5.79) v1(11.37,15.78) v1(11.94,4.57) v1(12.06,7.75) v1(12.06,6.72) v1(12.64,12.07) v1(12.83,7.75) v1(12.83,5.21) v1(12.83,4.57)
BOOT0: length 6.8
  Top Layer w0.203: R3.1 19.3,7.1 19.3,6.73 18.92,6.35 17.02,6.35 16.26,7.11
  Top Layer w0.254: U6.46 14.94,8.43 16.26,7.11 R2.2
CC1: length 7.3
  Top Layer w0.254: USB1.4 17.89,13.36 19.31,11.93 R9.1
CC2: length 13
  Top Layer w0.254: R10.1 22.48,8.75 22.48,14.1 20.22,16.36 USB1.10
DN: length 33.6
  Top Layer w0.203: v3(12.32,0.51) 12.45,0.64 12.45,1.91 11.8,2.55 U6.33 ; USB1.5 17.27,13.86 v1(17.27,14.37) 17.27,14.86 15.92,14.86 USB1.7
  Bottom Layer w0.203: v1(17.27,14.37) 16.38,14.37 16.13,14.62 16.13,15.21 16.6,15.68 17.85,15.68 19.15,14.37 19.15,6.87 18.95,6.67 18.85,6.67 18.65,6.47 18.65,6.27 18.85,6.06 18.95,6.06 19.15,5.86 19.15,5.66 18.95,5.45 18.85,5.45 18.65,5.25 18.65,5.05 18.85,4.84 18.95,4.84 19.15,4.64 19.15,3.31 18.49,2.64 12.65,2.64 12.45,2.44 12.45,0.64 v3(12.32,0.51)
DP: length 33.6
  Top Layer w0.203: USB1.8 14.61,15.36 v1(14.61,14.88) 14.61,14.35 15.91,14.35 USB1.6 ; U6.34 12.3,2.68 12.7,2.28 12.7,2.16 12.8,2.05 12.8,0.79 v3(13.08,0.51)
  Bottom Layer w0.203: v3(13.08,0.51) 12.83,0.76 12.83,2.21 12.9,2.29 18.8,2.29 19.51,3 19.51,14.52 17.99,16.04 16.45,16.04 15.77,15.36 15.77,14.7 15.7,14.62 14.86,14.62 v1(14.61,14.88)
GYRO_CS: length 6.7
  Top Layer w0.254: v2(6.99,10.29) 7.15,10.13 U6.12 ; v2(4.95,7.62) 4.95,8.16 4.85,8.26 U2.12
  Inner2 w0.254: v2(6.99,10.29) 6.55,10.72 6.02,10.72 4.95,9.65 v2(4.95,7.62)
GYRO_INT1: length 7.5
  Top Layer w0.254: U6.11 8.3,10.75 8.13,10.92 6.22,10.92 5.72,10.41 4.83,10.41 4.32,10.92 2.92,10.92 2.68,10.68 U2.4
GYRO_INT2: length 11.3
  Top Layer w0.254: U2.9 3.18,7.04 3.74,6.48 v2(3.94,6.48) ; v2(5.21,11.05) 5.84,11.05 6.1,11.3 8.64,11.3 8.8,11.14 U6.10
  Inner2 w0.254: v2(3.94,6.48) 4.32,6.86 4.32,10.16 v2(5.21,11.05)
GYRO_MISO: length 3.4
  Top Layer w0.254: U6.14 6.31,8.93 5.22,10.03 U2.1
GYRO_MOSI: length 3
  Top Layer w0.254: U2.14 5.34,9.26 6.18,8.43 U6.15
GYRO_SCLK: length 5.1
  Top Layer w0.254: v2(5.72,7.87) 5.72,8.13 5.08,8.76 U2.13 ; U6.13 6.7,9.43 v2(6.22,9.91)
  Inner2 w0.254: v2(5.72,7.87) 6.22,8.38 v2(6.22,9.91)
I2C_SCL: length 12.6
  Top Layer w0.203: U6.31 10.8,1.9 U9.4
  Top Layer w0.254: v3(18.16,5.84) 17.9,5.58 17.9,5.13
  Inner2 w0.254: U9.4 12.32,1.27 13.84,2.79 16.64,2.79 17.15,3.3 17.15,3.56 18.16,4.57 v3(18.16,5.84)
I2C_SDA: length 12.3
  Top Layer w0.203: v1(10.16,1.14) 10.3,1.28 U6.30
  Inner1 w0.254: v1(10.16,1.14) 10.16,1.78 10.8,2.41 12.47,2.41 13.61,1.27 U9.3
  Inner2 w0.254: v1(17.94,3.55) 16.8,2.41 14.99,2.41 13.97,1.4 U9.3
INT_OUT0: length 27.1
  Top Layer w0.254: v1(6.35,7.49) 7.03,7.49 U6.17
  Inner2 w0.254: v1(6.35,7.49) 7.62,8.76 7.62,18.54 11.56,22.48 14.86,22.48 U8.8
INT_OUT1: length 23.1
  Top Layer w0.254: U6.18 v1(5.33,6.92)
  Inner2 w0.254: U9.1 19.18,1.4 19.18,6.1 16,9.27 9.15,9.27 6.42,6.54 5.72,6.54 v1(5.33,6.92)
INT_OUT2: length 25
  Top Layer w0.203: 7.1,6.43 7.02,6.35 v1(4.7,6.35)
  Inner2 w0.254: U9.2 17.15,1.27 18.8,2.92 18.8,5.93 15.84,8.89 9.27,8.89 6.48,6.1 4.95,6.1 v1(4.7,6.35)
LED1: length 19.6
  Top Layer w0.203: U6.2 12.8,10.89 v1(12.95,11.05)
  Top Layer w0.254: v1(20.57,2.79) 20.57,2.25 LED1.1
  Inner2 w0.254: v1(12.95,11.05) 13.34,11.43 15.11,11.43 16.22,12.53 17.7,12.53 18.03,12.2 18.03,10.92 20.57,8.38 v1(20.57,2.79)
LED2: length 42.4
  Top Layer w0.254: v1(20.83,26.92) 21.76,26.92 LED2.1 ; v3(6.73,3.17) 7.1,3.54 U6.24
  Inner2 w0.203: v3(6.73,3.17) 5.72,3.17 2.79,6.1 2.79,7.24 3.56,8 3.56,9.02 3.18,9.4 3.18,15.88 4.7,17.4 4.7,20.83 6.86,22.99 12.7,22.99 14.1,24.38 v1(14.1,25.27)
  Bottom Layer w0.254: v1(14.1,25.27) 19.69,25.27 20.83,26.42 v1(20.83,26.92)
LPS22HHTR_DRDY: length 17.9
  Top Layer w0.203: U5.7 5.59,21.34 v2(7.75,21.34)
  Top Layer w0.254: v1(12.19,11.05) 12.3,10.94 U6.3
  Bottom Layer w0.254: v2(7.75,21.34) 7.75,12.19 8.76,11.18 12.06,11.18
LPS22HHTR_SCL: length 40.3
  Top Layer w0.254: 3.29,20.2 3.28,20.19 v2(2.29,20.19) ; v3(14.99,5.08) 14.99,4.95 14.46,4.43 U6.38 ; 3.6,13.47 3.06,13.47 v2(1.78,12.19) ; R4.1 v1(1,2.67)
  Inner2 w0.254: v3(14.99,5.08) 12.21,2.3 2.15,2.3 1.41,3.03 ; v2(2.29,20.19) 1.93,19.84 1.93,14.32 1.65,14.03 1.65,12.32 v2(1.78,12.19) 1.78,8.38 0.89,7.49 0.89,3.56 1.41,3.03 ; 1.41,3.03 1.37,3.03 v1(1,2.67)
LPS22HHTR_SDA: length 36.2
  Top Layer w0.254: U5.4 4.12,19.26 3.91,19.05 v2(2.67,19.05) ; U4.16 2.43,13.98 v2(2.41,13.97) ; v3(14.99,7.62) 14.68,7.93 U6.45
  Inner2 w0.203: v2(2.41,13.97) 2.41,18.8 v2(2.67,19.05)
  Inner2 w0.254: 4.1,3.17 4.61,2.67 9.27,2.67 14.22,7.62 v3(14.99,7.62) ; 4.1,3.17 2.16,3.17 1.27,4.06 1.27,7.11 2.41,8.25 v2(2.41,13.97) ; 4.1,3.17 4.19,3.27 v1(4.19,3.69)
NRST: length 4.9
  Top Layer w0.254: U6.7 10.3,11.04 10.16,11.18 9.6,11.18 8.74,12.03 R1.1 6.84,12.03 6.73,12.14
OSC_IN: length 6.3
  Top Layer w0.254: U6.5 11.3,10.7 11.56,10.96 11.56,12.73 X1.1 12.66,15.67 12.77,15.78
OSC_OUT: length 6
  Top Layer w0.254: 8.9,15.37 9.27,15 9.27,13.27 X1.3 10.8,11.74 U6.6
QMC5883_DRDY: length 27.1
  Top Layer w0.203: v3(14.99,6.98) 14.86,6.98 14.42,7.43 U6.44 ; v2(3.94,14.73) 3.69,14.48 U4.15
  Inner2 w0.254: v2(3.94,14.73) 3.94,7.75 3.18,6.98 3.18,6.35 3.68,5.84 4.19,5.84 4.44,5.59 6.6,5.59 9.55,8.53 15.21,8.53 15.88,7.87 15.88,6.98 v3(14.99,6.98)
RS485_DE: length 24.2
  Top Layer w0.254: v1(20.32,21.84) 21.94,21.84 22.07,21.72 22.07,22.99
  Inner2 w0.254: v1(20.32,21.84) 11.43,21.84 9.53,19.94 v2(9.53,10.41)
RS485A: length 10.7
  Top Layer w0.254: U8.6 15.24,25.4 17.53,25.4 18.29,24.64 18.29,23.59 17.68,22.99 15.09,22.99 R12.1
RS485B: length 10
  Top Layer w0.254: R12.2 14.85,21.72 17.53,21.72 18.8,22.99 18.8,24.74 16.87,26.67 U8.7
SPI_CS: length 7.7
  Top Layer w0.203: U9.8 2.61,2.61 7.8,2.61 U6.25
SPI_MISO: length 3.6
  Top Layer w0.203: U9.6 7.37,1.27 8.8,2.7 U6.27
SPI_MOSI: length 2.1
  Top Layer w0.203: U9.5 9.3,1.68 U6.28
SPI_SCLK: length 5.6
  Top Layer w0.203: U9.7 4.81,2.27 7.9,2.27 8.3,2.68 U6.26
SWCLK: length 2.3
  Top Layer w0.203: v3(15.24,4.45) 14.72,3.93 U6.37
  Bottom Layer w0.254: 15.96,4.83 15.58,4.45 v3(15.24,4.45)
SWDIO: length 5
  Top Layer w0.203: v3(15.11,3.56) 14.78,3.23 U6.36
  Bottom Layer w0.254: v3(15.11,3.56) 15.62,4.06 16.91,4.06 17.67,4.83
UART_RX: length 44.9
  Top Layer w0.203: 14,6.43 14.55,6.43 14.63,6.35 v3(14.99,6.35)
  Top Layer w0.254: v1(20.32,20.45) 22.07,20.45 ; U8.4 11.81,23.75 v1(12.19,23.75)
  Bottom Layer w0.254: v3(14.99,6.35) 16.64,6.35 18.16,7.87 18.16,12.7 17.65,13.21 15.88,13.21 15.85,13.23 14.71,13.23 13.23,14.71 13.23,21.31 8.89,25.65 U8.4 ; v1(20.32,20.45) 18.67,22.1 13.84,22.1 v1(12.19,23.75)
UART_TX: length 40.3
  Top Layer w0.203: U6.41 14.77,5.93 v3(14.99,5.72)
  Top Layer w0.254: v1(21.46,23.88) 21.84,24.26 22.07,24.26
  Bottom Layer w0.203: 16.89,5.97 15.62,5.97 15.37,5.72 v3(14.99,5.72) ; v1(21.46,23.88) 18.54,23.88 18.16,24.26 11.43,24.26
  Bottom Layer w0.254: 16.89,5.97 18.67,7.75 18.67,12.95 18.03,13.59 14.86,13.59 13.59,14.86 13.59,21.46 11.43,23.62 U8.5
$1N2964: length 1.8
  Top Layer w0.203: C13.2 4.6,17.35 U4.10
$1N3054: length 2.9
  Top Layer w0.203: U4.8 5.96,15.48 6.22,15.75 6.22,16.88 C14.1
$1N3058: length 7.1
  Top Layer w0.203: U4.12 2.79,16.8 2.79,18.29 3.18,18.67 6.62,18.67 C14.2
$1N3582: length 1.7
  Top Layer w0.203: U5.6 6.08,20.2 R6.2
$1N7651: length 1.5
  Top Layer w0.254: LED1.2 21.75,2.67 R11.2
$1N9567: length 14.1
  Top Layer w0.254: v2(13.08,24.89) 13.08,23.75 12.27,22.94 10.37,22.94 9.84,23.47 R21.2 ; LED2.2 v2(20.7,25.39)
  Bottom Layer w0.254: v2(20.7,25.39) 19.95,24.64 13.34,24.64 v2(13.08,24.89)

## Copper pours and planes (outline as drawn; the poured copper is in the pictures)
3V3 on Top Layer: 1.9,6.73 6.37,6.73 6.37,3.98 1.9,3.98
3V3 on Top Layer: 0.38,17.1 2.16,17.1 2.16,13.08 0.38,13.08
3V3 on Top Layer: 13.3,11.03 16.89,11.03 16.89,8.13 13.3,8.13
3V3 on Bottom Layer: 13.4,10.98 14.9,10.98 14.9,9.58 13.4,9.58
3V3 on Bottom Layer: 0.38,16.64 2.16,16.64 2.16,13.08 0.38,13.08
3V3 on Bottom Layer: 1.79,6.76 6.44,6.76 6.44,3.92 1.79,3.92
+5V on Top Layer: 13.59,13.76 15.04,13.76 15.04,11.56 13.59,11.56
GND on Inner1: -4.06,30.86 24.38,30.86 24.38,-1.14 -4.06,-1.14
